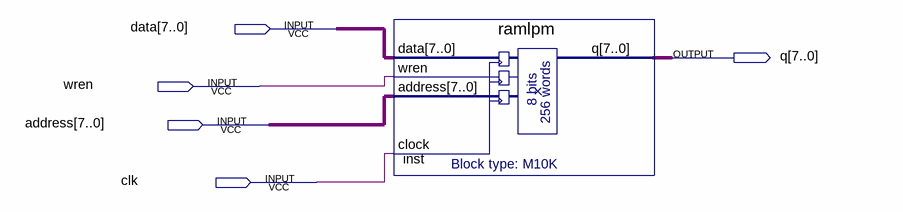
[diagram p0: schematic sheet]
// Quartus schematic lab6_ramlpm_tb.bdf as structural Verilog: 1 symbols, 5 pins
module lab6_ramlpm_tb (
  input  [7:0] data,
  input  wren,
  input  [7:0] address,
  input  clk,
  output [7:0] q
);

  ramlpm inst (.data(data), .wren(wren), .address(address), .clock(clk), .q(q));
endmodule
